# EasyEDA schematic sch_claudia-2.0-the-real-thing_2026-05-15.json
TITLE: Sheet_1; REV: 1.0; Date: 2026-05-14; Sheet: 1/1; Drawn By: lastsurvivor857; Company: Your Company
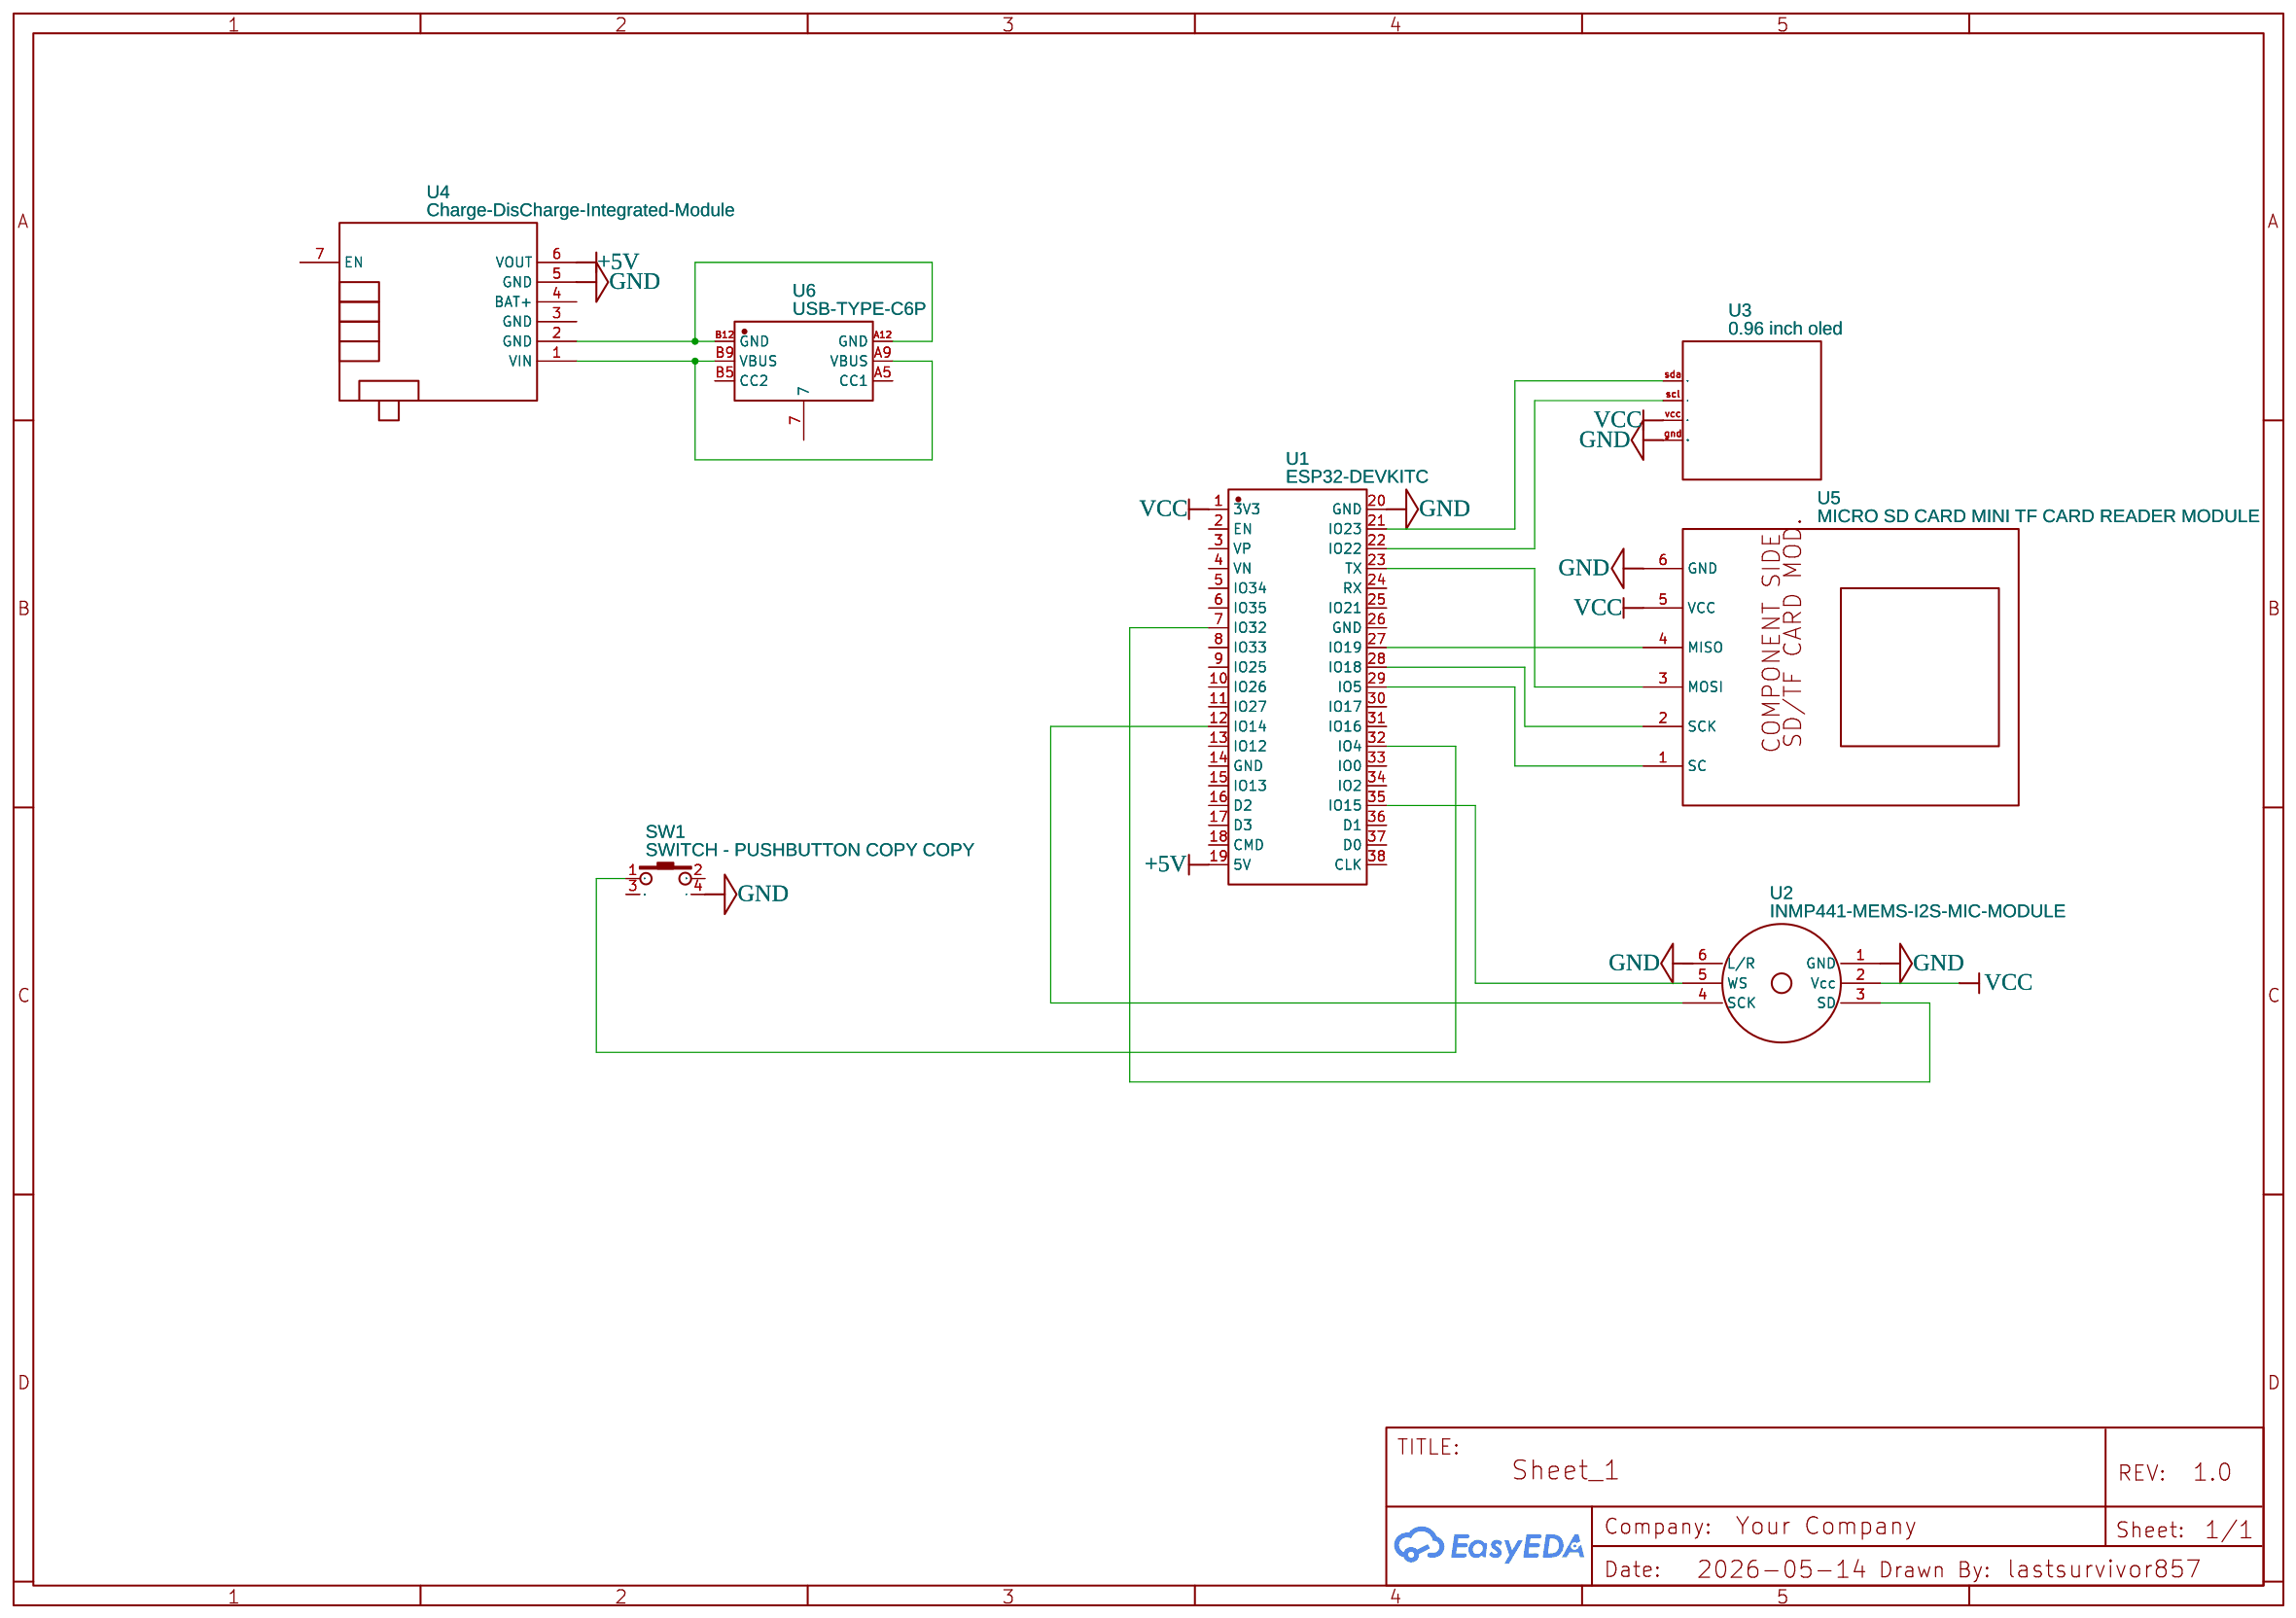
[diagram p0: schematic sheet]

## Parts
SW1  SWITCH - PUSHBUTTON COPY COPY  [SWITCH-MINI-PUSHBUTTON]
U1  ESP32-DEVKITC  [BULETM-SMD_ESP32-DEVKITC]
U2  INMP441-MEMS-I2S-MIC-MODULE  [INMP441-MEMS-I2S-MIC-MODULE]
U3  0.96 inch oled  [0.96 INCH OLED]
U4  Charge-DisCharge-Integrated-Module  [CHARGE DISCHARGE INTEGRATED MODULE]
U5  MICRO SD CARD MINI TF CARD READER MODULE  [SD/TF CARD]
U6  USB-TYPE-C6P  [TYPE-C-SMD_TYPE-C-6P-1]

## Library data of the parts
SW1 = push button reset: Contributor: LHKhoo
U1 = ESP32-DEVKITC: Supplier: LCSC; Supplier Part: C571180; Manufacturer: ESPRESSIF(乐鑫); Manufacturer Part: ESP32-DevKitC; Contributor: lcsc
U2 = INMP441-MEMS-I2S-MIC-MODULE: Supplier: ebay; link: https://www.ebay.de/itm/174127178542; Contributor: simpaleannicolae
U3 = 0.96 inch oled: Supplier: self; Contributor: saadmuhammad262
U4 = Charge-DisCharge-Integrated-Module: Contributor: tianyihu
U5 = MICRO SD CARD MINI TF CARD READER MODULE: Contributor: szmichael
U6 = USB-TYPE-C6P: Contributor: LCSC; Supplier: LCSC; Supplier Part: C9900001831; Manufacturer: null; JLCPCB Part Class: Extended Part

## Nets
+5V: U1.19(5V) U4.6(VOUT)
GND: SW1.4 U1.20(GND) U2.1(GND) U3.gnd U4.5(GND) U5.6(GND)
VCC: U1.1(3V3) U2.2(Vcc) U3.vcc(2) U5.5(VCC)
Net-(SW1-1): SW1.1 U1.32(IO4)
Net-(U1-7): U1.7(IO32) U2.3(SD)
Net-(U1-12): U1.12(IO14) U2.4(SCK)
Net-(U1-21): U1.21(IO23) U3.sda(3)
Net-(U1-22): U1.22(IO22) U3.scl(4)
Net-(U1-23): U1.23(TX) U5.3(MOSI)
Net-(U1-27): U1.27(IO19) U5.4(MISO)
Net-(U1-28): U1.28(IO18) U5.2(SCK)
Net-(U1-29): U1.29(IO5) U5.1(SC)
Net-(U1-35): U1.35(IO15) U2.5(WS)
Net-(U4-1): U4.1(VIN) U6.A9(VBUS) U6.B9(VBUS)
Net-(U4-2): U4.2(GND) U6.A12(GND) U6.B12(GND)

Not connected (* = marked no-connect by the designer): SW1 2 3; U1 2(EN) 3(VP) 4(VN) 5(IO34) 6(IO35) 8(IO33) 9(IO25) 10(IO26) 11(IO27) 13(IO12) 14(GND) 15(IO13) 16(D2) 17(D3) 18(CMD) 24(RX) 25(IO21) 26(GND) 30(IO17) 31(IO16) 33(IO0) 34(IO2) 36(D1) 37(D0) 38(CLK); U2 6(L/R); U4 3(GND) 4(BAT+) 7(EN); U6 7 A5(CC1) B5(CC2)
